# Altium schematic sheet as14120_fpga_cypress.SchDoc
size A3
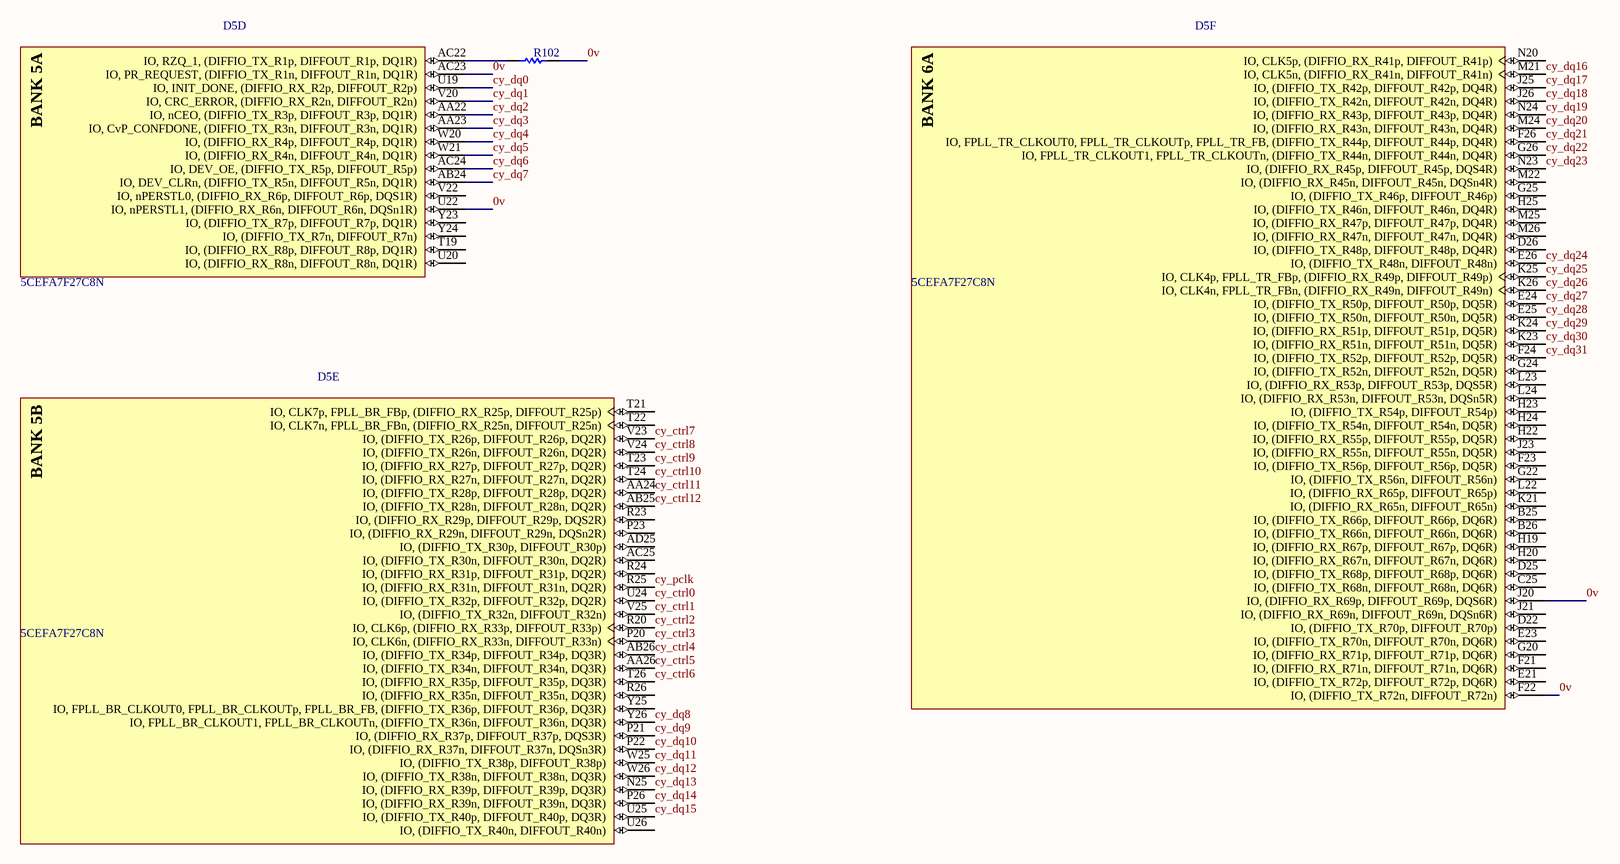
[diagram p0: as14120_fpga_cypress.SchDoc]

## Parts
D5  5CEFA7F27C8N  [ALTR-672-FBGA-2000A]  (parts D,E,F of 12)
R102  ???  [RESC0603(1608)_L]  (value not drawn)

## Nets
0v: D5.AC23(IO,_PR_REQUEST,_(DIFFIO_TX_R1n,_DIFFOUT_R1n,_DQ1R)) D5.F22(IO,_(DIFFIO_TX_R72n,_DIFFOUT_R72n)) D5.J20(IO,_(DIFFIO_RX_R69p,_DIFFOUT_R69p,_DQS6R)) D5.U22(IO,_nPERSTL1,_(DIFFIO_RX_R6n,_DIFFOUT_R6n,_DQSn1R)) R102.2
cy_ctrl0: D5.U24(IO,_(DIFFIO_TX_R32p,_DIFFOUT_R32p,_DQ2R))
cy_ctrl1: D5.V25(IO,_(DIFFIO_TX_R32n,_DIFFOUT_R32n))
cy_ctrl2: D5.R20(IO,_CLK6p,_(DIFFIO_RX_R33p,_DIFFOUT_R33p))
cy_ctrl3: D5.P20(IO,_CLK6n,_(DIFFIO_RX_R33n,_DIFFOUT_R33n))
cy_ctrl4: D5.AB26(IO,_(DIFFIO_TX_R34p,_DIFFOUT_R34p,_DQ3R))
cy_ctrl5: D5.AA26(IO,_(DIFFIO_TX_R34n,_DIFFOUT_R34n,_DQ3R))
cy_ctrl6: D5.T26(IO,_(DIFFIO_RX_R35p,_DIFFOUT_R35p,_DQ3R))
cy_ctrl7: D5.V23(IO,_(DIFFIO_TX_R26p,_DIFFOUT_R26p,_DQ2R))
cy_ctrl8: D5.V24(IO,_(DIFFIO_TX_R26n,_DIFFOUT_R26n,_DQ2R))
cy_ctrl9: D5.T23(IO,_(DIFFIO_RX_R27p,_DIFFOUT_R27p,_DQ2R))
cy_ctrl10: D5.T24(IO,_(DIFFIO_RX_R27n,_DIFFOUT_R27n,_DQ2R))
cy_ctrl11: D5.AA24(IO,_(DIFFIO_TX_R28p,_DIFFOUT_R28p,_DQ2R))
cy_ctrl12: D5.AB25(IO,_(DIFFIO_TX_R28n,_DIFFOUT_R28n,_DQ2R))
cy_dq0: D5.U19(IO,_INIT_DONE,_(DIFFIO_RX_R2p,_DIFFOUT_R2p))
cy_dq1: D5.V20(IO,_CRC_ERROR,_(DIFFIO_RX_R2n,_DIFFOUT_R2n))
cy_dq2: D5.AA22(IO,_nCEO,_(DIFFIO_TX_R3p,_DIFFOUT_R3p,_DQ1R))
cy_dq3: D5.AA23(IO,_CvP_CONFDONE,_(DIFFIO_TX_R3n,_DIFFOUT_R3n,_DQ1R))
cy_dq4: D5.W20(IO,_(DIFFIO_RX_R4p,_DIFFOUT_R4p,_DQ1R))
cy_dq5: D5.W21(IO,_(DIFFIO_RX_R4n,_DIFFOUT_R4n,_DQ1R))
cy_dq6: D5.AC24(IO,_DEV_OE,_(DIFFIO_TX_R5p,_DIFFOUT_R5p))
cy_dq7: D5.AB24(IO,_DEV_CLRn,_(DIFFIO_TX_R5n,_DIFFOUT_R5n,_DQ1R))
cy_dq8: D5.Y26(IO,_FPLL_BR_CLKOUT1,_FPLL_BR_CLKOUTn,_(DIFFIO_TX_R36n,_DIFFOUT_R36n,_DQ3R))
cy_dq9: D5.P21(IO,_(DIFFIO_RX_R37p,_DIFFOUT_R37p,_DQS3R))
cy_dq10: D5.P22(IO,_(DIFFIO_RX_R37n,_DIFFOUT_R37n,_DQSn3R))
cy_dq11: D5.W25(IO,_(DIFFIO_TX_R38p,_DIFFOUT_R38p))
cy_dq12: D5.W26(IO,_(DIFFIO_TX_R38n,_DIFFOUT_R38n,_DQ3R))
cy_dq13: D5.N25(IO,_(DIFFIO_RX_R39p,_DIFFOUT_R39p,_DQ3R))
cy_dq14: D5.P26(IO,_(DIFFIO_RX_R39n,_DIFFOUT_R39n,_DQ3R))
cy_dq15: D5.U25(IO,_(DIFFIO_TX_R40p,_DIFFOUT_R40p,_DQ3R))
cy_dq16: D5.M21(IO,_CLK5n,_(DIFFIO_RX_R41n,_DIFFOUT_R41n))
cy_dq17: D5.J25(IO,_(DIFFIO_TX_R42p,_DIFFOUT_R42p,_DQ4R))
cy_dq18: D5.J26(IO,_(DIFFIO_TX_R42n,_DIFFOUT_R42n,_DQ4R))
cy_dq19: D5.N24(IO,_(DIFFIO_RX_R43p,_DIFFOUT_R43p,_DQ4R))
cy_dq20: D5.M24(IO,_(DIFFIO_RX_R43n,_DIFFOUT_R43n,_DQ4R))
cy_dq21: D5.F26(IO,_FPLL_TR_CLKOUT0,_FPLL_TR_CLKOUTp,_FPLL_TR_FB,_(DIFFIO_TX_R44p,_DIFFOUT_R44p,_DQ4R))
cy_dq22: D5.G26(IO,_FPLL_TR_CLKOUT1,_FPLL_TR_CLKOUTn,_(DIFFIO_TX_R44n,_DIFFOUT_R44n,_DQ4R))
cy_dq23: D5.N23(IO,_(DIFFIO_RX_R45p,_DIFFOUT_R45p,_DQS4R))
cy_dq24: D5.E26(IO,_(DIFFIO_TX_R48n,_DIFFOUT_R48n))
cy_dq25: D5.K25(IO,_CLK4p,_FPLL_TR_FBp,_(DIFFIO_RX_R49p,_DIFFOUT_R49p))
cy_dq26: D5.K26(IO,_CLK4n,_FPLL_TR_FBn,_(DIFFIO_RX_R49n,_DIFFOUT_R49n))
cy_dq27: D5.E24(IO,_(DIFFIO_TX_R50p,_DIFFOUT_R50p,_DQ5R))
cy_dq28: D5.E25(IO,_(DIFFIO_TX_R50n,_DIFFOUT_R50n,_DQ5R))
cy_dq29: D5.K24(IO,_(DIFFIO_RX_R51p,_DIFFOUT_R51p,_DQ5R))
cy_dq30: D5.K23(IO,_(DIFFIO_RX_R51n,_DIFFOUT_R51n,_DQ5R))
cy_dq31: D5.F24(IO,_(DIFFIO_TX_R52p,_DIFFOUT_R52p,_DQ5R))
cy_pclk: D5.R25(IO,_(DIFFIO_RX_R31n,_DIFFOUT_R31n,_DQ2R))
NetD5_AC22: D5.AC22(IO,_RZQ_1,_(DIFFIO_TX_R1p,_DIFFOUT_R1p,_DQ1R)) R102.1

Not connected (* = marked no-connect by the designer): D5 AC25(IO,_(DIFFIO_TX_R30n,_DIFFOUT_R30n,_DQ2R)) AD25(IO,_(DIFFIO_TX_R30p,_DIFFOUT_R30p)) B25(IO,_(DIFFIO_TX_R66p,_DIFFOUT_R66p,_DQ6R)) B26(IO,_(DIFFIO_TX_R66n,_DIFFOUT_R66n,_DQ6R)) C25(IO,_(DIFFIO_TX_R68n,_DIFFOUT_R68n,_DQ6R)) D22(IO,_(DIFFIO_TX_R70p,_DIFFOUT_R70p)) D25(IO,_(DIFFIO_TX_R68p,_DIFFOUT_R68p,_DQ6R)) D26(IO,_(DIFFIO_TX_R48p,_DIFFOUT_R48p,_DQ4R)) E21(IO,_(DIFFIO_TX_R72p,_DIFFOUT_R72p,_DQ6R)) E23(IO,_(DIFFIO_TX_R70n,_DIFFOUT_R70n,_DQ6R)) F21(IO,_(DIFFIO_RX_R71n,_DIFFOUT_R71n,_DQ6R)) F23(IO,_(DIFFIO_TX_R56p,_DIFFOUT_R56p,_DQ5R)) G20(IO,_(DIFFIO_RX_R71p,_DIFFOUT_R71p,_DQ6R)) G22(IO,_(DIFFIO_TX_R56n,_DIFFOUT_R56n)) G24(IO,_(DIFFIO_TX_R52n,_DIFFOUT_R52n,_DQ5R)) G25(IO,_(DIFFIO_TX_R46p,_DIFFOUT_R46p)) H19(IO,_(DIFFIO_RX_R67p,_DIFFOUT_R67p,_DQ6R)) H20(IO,_(DIFFIO_RX_R67n,_DIFFOUT_R67n,_DQ6R)) H22(IO,_(DIFFIO_RX_R55p,_DIFFOUT_R55p,_DQ5R)) H23(IO,_(DIFFIO_TX_R54p,_DIFFOUT_R54p)) H24(IO,_(DIFFIO_TX_R54n,_DIFFOUT_R54n,_DQ5R)) H25(IO,_(DIFFIO_TX_R46n,_DIFFOUT_R46n,_DQ4R)) J21(IO,_(DIFFIO_RX_R69n,_DIFFOUT_R69n,_DQSn6R)) J23(IO,_(DIFFIO_RX_R55n,_DIFFOUT_R55n,_DQ5R)) K21(IO,_(DIFFIO_RX_R65n,_DIFFOUT_R65n)) L22(IO,_(DIFFIO_RX_R65p,_DIFFOUT_R65p)) L23(IO,_(DIFFIO_RX_R53p,_DIFFOUT_R53p,_DQS5R)) L24(IO,_(DIFFIO_RX_R53n,_DIFFOUT_R53n,_DQSn5R)) M22(IO,_(DIFFIO_RX_R45n,_DIFFOUT_R45n,_DQSn4R)) M25(IO,_(DIFFIO_RX_R47p,_DIFFOUT_R47p,_DQ4R)) M26(IO,_(DIFFIO_RX_R47n,_DIFFOUT_R47n,_DQ4R)) N20(IO,_CLK5p,_(DIFFIO_RX_R41p,_DIFFOUT_R41p)) P23(IO,_(DIFFIO_RX_R29n,_DIFFOUT_R29n,_DQSn2R)) R23(IO,_(DIFFIO_RX_R29p,_DIFFOUT_R29p,_DQS2R)) R24(IO,_(DIFFIO_RX_R31p,_DIFFOUT_R31p,_DQ2R)) R26(IO,_(DIFFIO_RX_R35n,_DIFFOUT_R35n,_DQ3R)) T19(IO,_(DIFFIO_RX_R8p,_DIFFOUT_R8p,_DQ1R)) T21(IO,_CLK7p,_FPLL_BR_FBp,_(DIFFIO_RX_R25p,_DIFFOUT_R25p)) T22(IO,_CLK7n,_FPLL_BR_FBn,_(DIFFIO_RX_R25n,_DIFFOUT_R25n)) U20(IO,_(DIFFIO_RX_R8n,_DIFFOUT_R8n,_DQ1R)) U26(IO,_(DIFFIO_TX_R40n,_DIFFOUT_R40n)) V22(IO,_nPERSTL0,_(DIFFIO_RX_R6p,_DIFFOUT_R6p,_DQS1R)) Y23(IO,_(DIFFIO_TX_R7p,_DIFFOUT_R7p,_DQ1R)) Y24(IO,_(DIFFIO_TX_R7n,_DIFFOUT_R7n)) Y25(IO,_FPLL_BR_CLKOUT0,_FPLL_BR_CLKOUTp,_FPLL_BR_FB,_(DIFFIO_TX_R36p,_DIFFOUT_R36p,_DQ3R))

## Notes on the sheet
- Title
- Size:
- Date:
- A3
- Number:
- Time:
- Revision:
- Sheet
- of
- File:
- (in symbol 5CEFA7F27C8N, part D) BANK 5A
- (in symbol 5CEFA7F27C8N, part E) BANK 5B
- (in symbol 5CEFA7F27C8N, part F) BANK 6A

## Library data of the parts
D5 = 5CEFA7F27C8N: Cyclone V E Family FPGA, 1.07 to 1.13 V Supply, 336 I/O Pins, 7 PLLs, 672-Pin FBGA, Speed Grade 8, Commercial Grade, RoHS Compliant; Manufacturer: Altera; Device Group: 5CEFA7; GPIO: 336; Logic Elements (LE) (K): 149.5; Speed Grade: 8; DatasheetVersion: Rev. 3.1; PackageReference: 672-FBGA-2000A; PackageDescription: 672-Pin FineLine Ball-Grid Array (FBGA), Body 27 x 27 mm, Pitch 1 mm; Supplier 1: Digi-Key; Supplier Part Number 1: 5CEFA7F27C8N-ND; Supplier 2: Mouser; Supplier Part Number 2: 989-5CEFA7F27C8N; RoHS: RoHS Compliant; Subcategory: Cyclone V E; Voltage Supply: 1.07 to 1.13 V; Mounting Technology: Surface Mount; Code_JEDEC: MS-034-AAL-1; PartNumber: 5CEFA7F27C8N; ComponentLink1Description: Manufacturer URL; ComponentLink1URL: http://www.altera.com; ComponentLink2Description: Datasheet; ComponentLink2URL: http://www.altera.com/literature/hb/cyclone-v/cv_51002.pdf; ComponentLink3Description: Package Specification; ComponentLink3URL: http://www.altera.com/devicepackaging/04R00427-01.pdf; ComponentLink4Description: Device Handbook URL; ComponentLink4URL: http://www.altera.com/literature/hb/cyclone-v/cyclone5_handbook.pdf; ComponentLink5Description: Device Overview URL; ComponentLink5URL: http://www.altera.com/literature/hb/cyclone-v/cv_51001.pdf; ComponentLink6Description: Device Pin-Out URL; ComponentLink6URL: http://www.altera.com/literature/dp/cyclone-v/1.1.txt; ComponentLink7Description: Product URL; ComponentLink7URL: http://www.buyaltera.com/scripts/partsearch.dll?Detail&name=5CEFA7F27C8N-ND
R102 = RES_0603: 1K 0.1W 5% 0603 (1608 Metric)  SMD; Case-EIA: 0603; Case-Metric: 1608; Technology: SMT; Value: ???; Tolerance: 5 %; Power: 0.1 W